# EAGLE schematic house_interior_board (EAGLE 7.0.0)
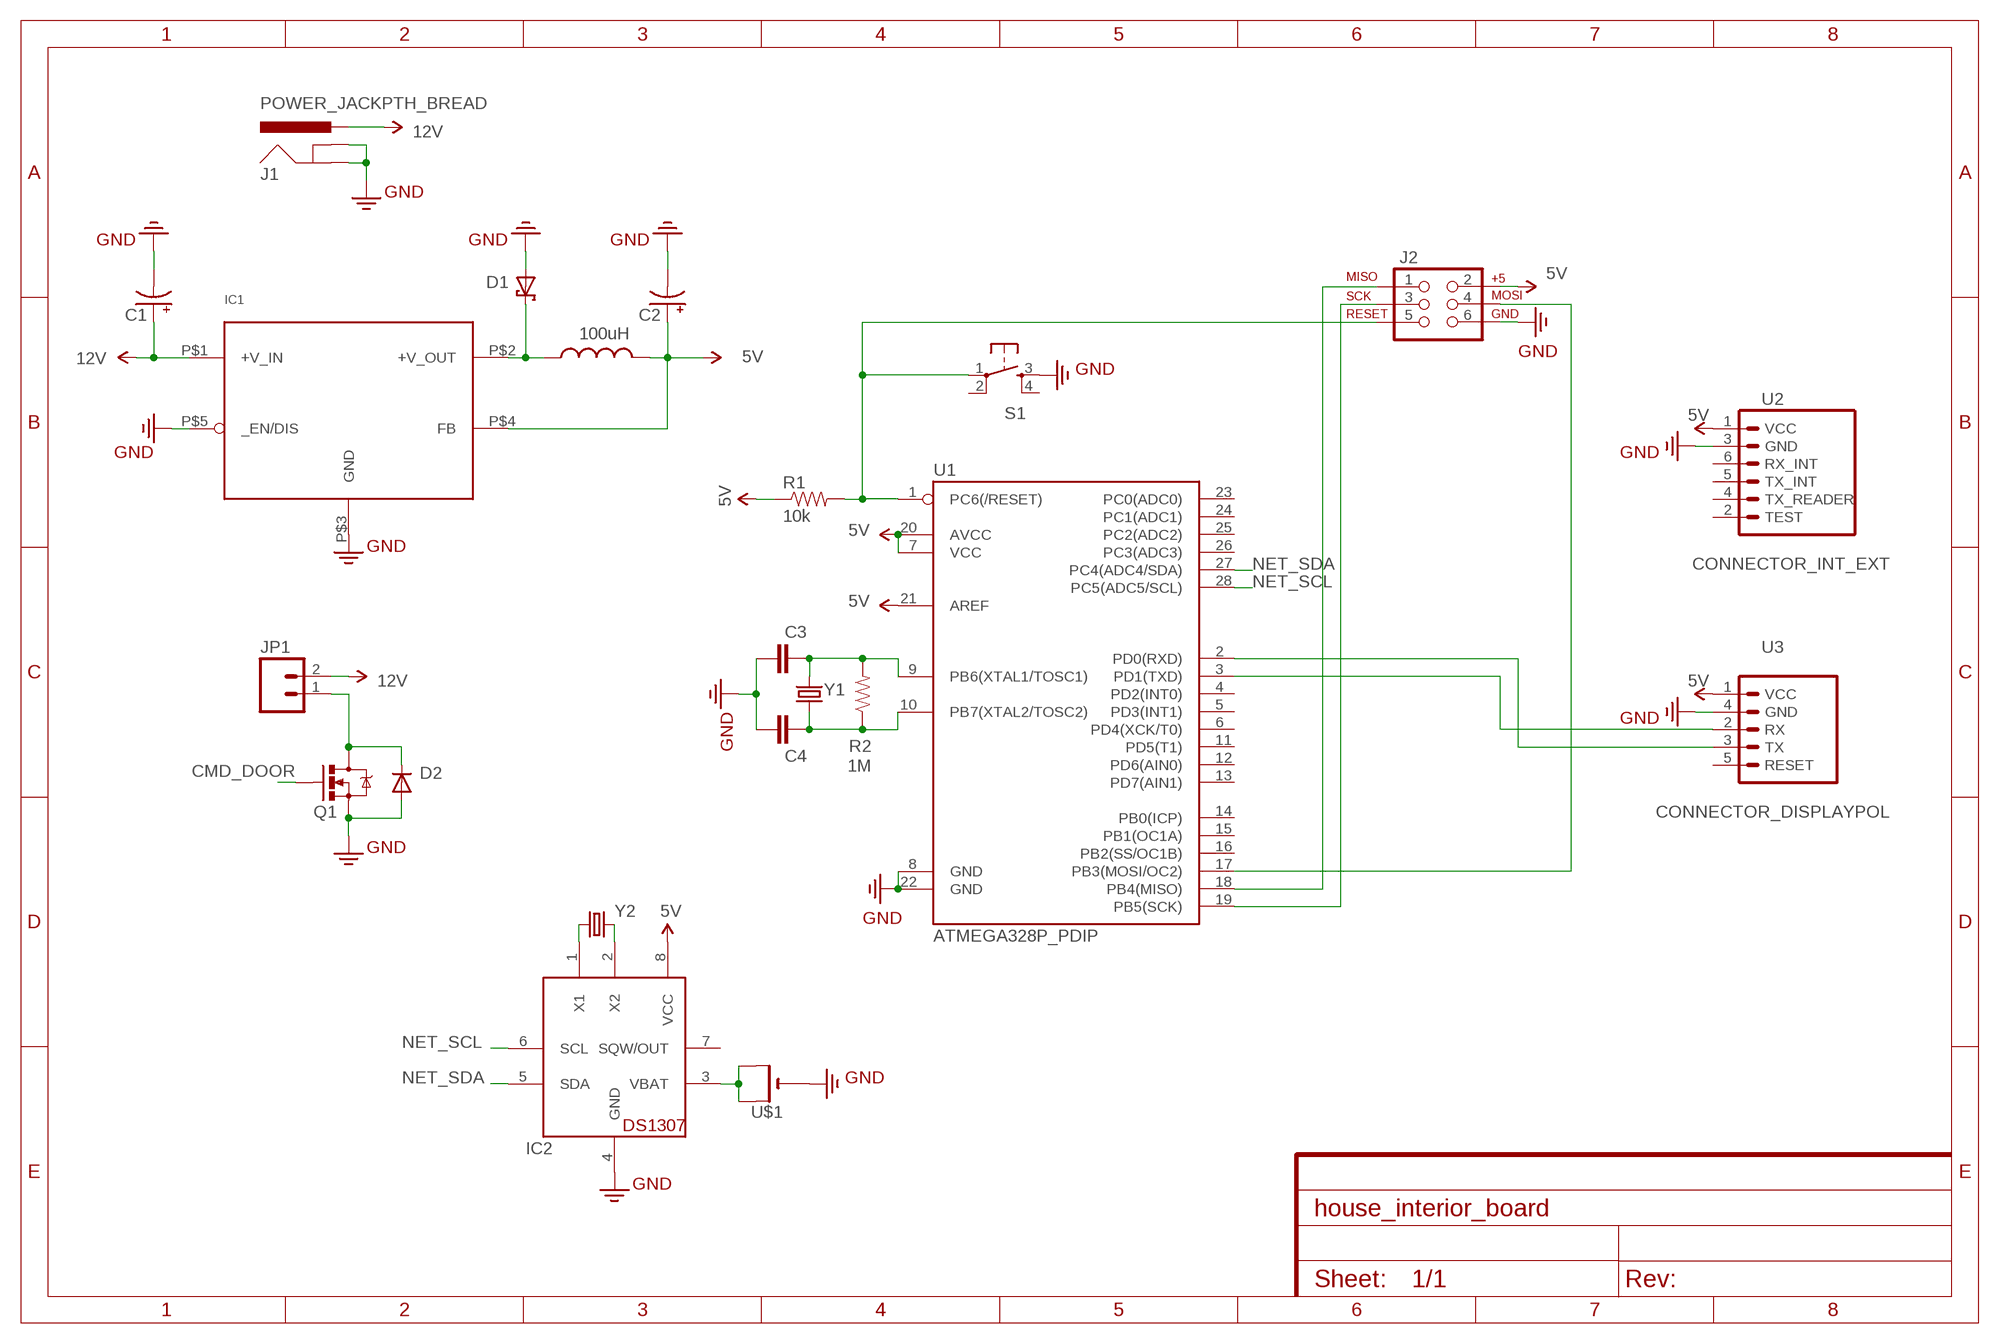
[diagram p0: schematic, sheet 1]

## Parts
C1  100UF-25V-20%(PTH)  [CPOL-RADIAL-100UF-25V]
C2  CAP-09538  1000UF-25V(PTH)  [CPOL-RADIAL-1000UF-25V]
C3  22PF-50VPTH  [CAP-PTH-SMALL]
C4  22PF-50VPTH  [CAP-PTH-SMALL]
D1  1N5822PTH  [DO201T15]
D2  1N4004  [DO41-10]
IC1  LM2576-T05A  [TO-220-5_IN-LINE]
IC2  DS1307  [DIL08]
J1  POWER_JACKPTH_BREAD  [POWER_JACK_PTH_BREAD]
J2  AVR_SPI_PRG_6PTH  [2X3]
JP1  M02JST-PTH-VERT  [JST-2-PTH-VERT]
L1  100uH  INDUCTORRLB0912  [RLB0912]
Q1  MOSFET-NCHANNELFQP30N06L  [TO220V]
R1  10k  10KOHM-1/4W-1%(PTH)HORIZ  [AXIAL-0.3]
R2  1M  1MOHM1/10W1%(0603)HON  [AXIAL-0.3]
S1  TAC_SWITCHPTH  [TACTILE-PTH]
U1  ATMEGA328P_PDIP  [DIL28-3]
U2  CONNECTOR_INT_EXT  [1X06_COMMON]
U3  CONNECTOR_DISPLAYPOL  [1X05_POL]
U$1  CR1220THM  [CR1220-THM]
Y1  CRYSTALHC49US  [HC49US]
Y2  CRYSTALTC26H  [TC26H]

## Nets
5V: C2.+ IC1.P$4(FB) IC2.8(VCC) J2.2 L1.2 R1.P$1 U1.7(VCC) U1.20(AVCC) U1.21(AREF) U2.1(VCC) U3.1(VCC)
12V: C1.1(+) IC1.P$1(+V_IN) J1.PWR JP1.2
CMD_DOOR: Q1.1(G)
GND: C1.2(-) C2.- C3.2 C4.2 D1.A D2.A IC1.P$3(GND) IC1.P$5(_EN/DIS) IC2.4(GND) J1.GND J1.GNDBREAK J2.6 Q1.3(S) S1.3 U1.8(GND) U1.22(GND) U2.3(GND) U3.4(GND) U$1.-
N$1: D1.C IC1.P$2(+V_OUT) L1.1
N$2: U1.2(PD0(RXD)) U3.3(TX)
N$3: D2.C JP1.1 Q1.2(D)
N$4: J2.3 U1.19(PB5(SCK))
N$5: J2.1 U1.18(PB4(MISO))
N$6: J2.4 U1.17(PB3(MOSI/OC2))
N$7: C3.1 R2.P$2 U1.9(PB6(XTAL1/TOSC1)) Y1.2
N$8: J2.5 R1.P$2 S1.1 U1.1(PC6(/RESET))
N$9: C4.1 R2.P$1 U1.10(PB7(XTAL2/TOSC2)) Y1.1
N$10: U1.3(PD1(TXD)) U3.2(RX)
N$11: IC2.1(X1) Y2.1
N$12: IC2.2(X2) Y2.2
N$15: IC2.3(VBAT) U$1.+1(+) U$1.+2(+1)
NET_SCL: IC2.6(SCL) U1.28(PC5(ADC5/SCL))
NET_SDA: IC2.5(SDA) U1.27(PC4(ADC4/SDA))
Unconnected: IC2.7(SQW/OUT) S1.2 S1.4 U1.4(PD2(INT0)) U1.5(PD3(INT1)) U1.6(PD4(XCK/T0)) U1.11(PD5(T1)) U1.12(PD6(AIN0)) U1.13(PD7(AIN1)) U1.14(PB0(ICP)) U1.15(PB1(OC1A)) U1.16(PB2(SS/OC1B)) U1.23(PC0(ADC0)) U1.24(PC1(ADC1)) U1.25(PC2(ADC2)) U1.26(PC3(ADC3)) U2.2(TEST) U2.4(TX_READER) U2.5(TX_INT) U2.6(RX_INT) U3.5(RESET)

## Library data of the parts
C1 = nerdvellous_house_manager:100UF-25V-20%(PTH): CAP-08439
C2 = nerdvellous_house_manager:1000UF-25V(PTH): CAP-08070; PROD_ID: CAP-09538
C3 C4 = nerdvellous_house_manager:22PF-50V: CAP-07876
D1 = nerdvellous_house_manager:1N5822: SCHOTTKY BARRIER RECTIFIER 3.0 AMPERES 20, 30, 40 VOLT Source: MBRS340T3-D.pdf
D2 = nerdvellous_house_manager:1N4004: DIODE general purpose rectifier, 1 A
IC1 = nerdvellous_house_manager:LM2576-T05A: LM2576/LM2576HV Series SIMPLE SWITCHER® 3A Step-Down Voltage Regulator IN-LINE PACKAGE
IC2 = nerdvellous_house_manager:DS1307: DS1307 Real time clock (RTC) with battery backup ability. Talk to it via i2c
J1 = nerdvellous_house_manager:POWER_JACK: Power Jack This is the standard 5.5mm barrel jack for power. The PTH is the most common, proven, reliable, footprint. The Slot footprint only works if the mill layer is transmitted to the PCB fab house so be warned. Mating wall wart : TOL-00298 (and others); PROD_ID: PRT-10811
J2 = nerdvellous_house_manager:AVR_SPI_PRG_6: AVR ISP 6 Pin This is the reduced ISP connector for AVR programming. Common on Arduino. This footprint will take up less PCB space and can be used with a 10-pin to 6-pin adapter such as SKU: BOB-08508 **Special note about "TEST_POINT" package. The stop mask is on the top side, so if you want your programming test points to be on the bottom of your board, make sure to place this package on the bottom side of the board. This also ensure that the orientation to program from the bottom side will be correct.
JP1 = nerdvellous_house_manager:M02: Standard 2-pin 0.1" header. Use with - straight break away headers ( PRT-00116) - right angle break away headers (PRT-00553) - swiss pins (PRT-00743) - machine pins (PRT-00117) - female headers (PRT-00115) Molex polarized connector foot print use with: PRT-08233 with associated crimp pins and housings. 2.54_SCREWTERM for use with PRT-10571. 3.5mm Screw Terminal footprints for PRT-08084 5mm Screw Terminal footprints for use with PRT-08433
L1 = nerdvellous_house_manager:INDUCTOR: Inductors Basic Inductor/Choke - 0603 and 1206. Footprints are not proven and vary greatly between part numbers. SRN6045- 33uH, 20% 1.4A SDR0403-560KL - 56uH, 10%, 500mA RMS/740mA peak
Q1 = nerdvellous_house_manager:MOSFET-NCHANNEL: Common NMOSFET Parts MFG P/N Store ID Prod ID FDD8780 TRANS-09984 SI7820DN TRANS-11055 FDS6630A IC-08089 2N7002PW TRANS-11151 FQP30N06L COM-10213 TRANS-10060 BSS123LT1G TRANS-08345 BSS138 TRANS-00830 BS170 2N7000; PROD_ID: TRANS-10060
R1 = nerdvellous_house_manager:10KOHM-1/4W-1%(PTH): RES-12183; PROD_ID: RES-12183
R2 = nerdvellous_house_manager:1MOHM1/10W1%(0603): RES-07868
S1 = nerdvellous_house_manager:TAC_SWITCH: Momentary Switch Button commonly used for reset or general input. Spark Fun Electronics SKU : COM-00097 SMT- SWCH-08247
U1 = nerdvellous_house_manager:ATMEGA328P_PDIP: uC used in the Arduino 32kb flash, 1k EEPROM, 2k SRAM This is the through-hole version of this chip.
U2 = nerdvellous_house_manager:CONNECTOR_INT_EXT
U3 = nerdvellous_house_manager:CONNECTOR_DISPLAY
U$1 = nerdvellous_house_manager:CR1220: CR1216/CR1220/CR1225 12mm 3V lithium coin cell Great for battery packup. Both SMT and THM holders. Note the THM package has the ground pads on both sides of the PCB so that the masks are the same - this reduces the cost
Y1 Y2 = nerdvellous_house_manager:CRYSTAL: Various standard crystals. Proven footprints. Spark Fun Electronics SKU : COM-00534